# Altium schematic sheet Sheet1.SchDoc: Линейный стабилизатор напряжения
size 420 x 297 mm; CheckedBy: Хисамов; Author: Лыков; SheetNumber: 1; SheetTotal: 1
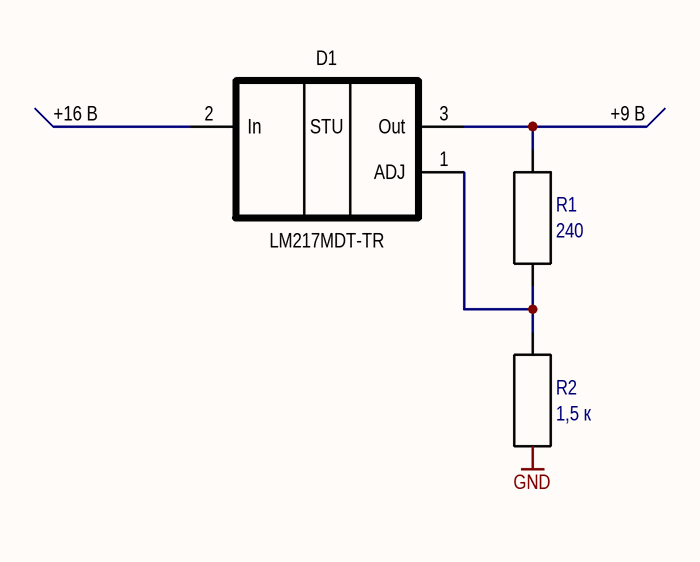
[diagram p0: Sheet1.SchDoc]

## Parts
D1  LM217MDT-TR
R1  value 240
R2  value 1,5 к

## Nets
NetD1_1: D1.1(ADJ) R1.2 R2.1
NetD1_3: D1.3(Out) R1.1

Not connected (* = marked no-connect by the designer): D1 2(In); R2 2

## Notes on the sheet
- +16 В
- (near R1) +9 В
- Labels drawn without touching a wire or pin: GND
- Перв.примен.
- Справ. №
- Подп. и дата
- Инв.№ дубл.
- Взам. инв. №
- Изм.
- Лист
- № докум.
- Подп.
- Дата
- Лит.
- Масса
- Масштаб
- Пров.
- Т.контр
- Разраб.
- Схема электрическая принципиальная
- 1
- Листов
- Инв № подл.
- Н.контр.
- Утв.
- Копировал
- Формат А3
- (in symbol LM217MDT-TR) STU

## Library data of the parts
R1 R2 = R: Company: *; PartNumber: *; Package: *; Tolerance: *